# Altium schematic sheet High Speed User IO.SchDoc
size A2; SheetNumber: 12; SheetTotal: 13
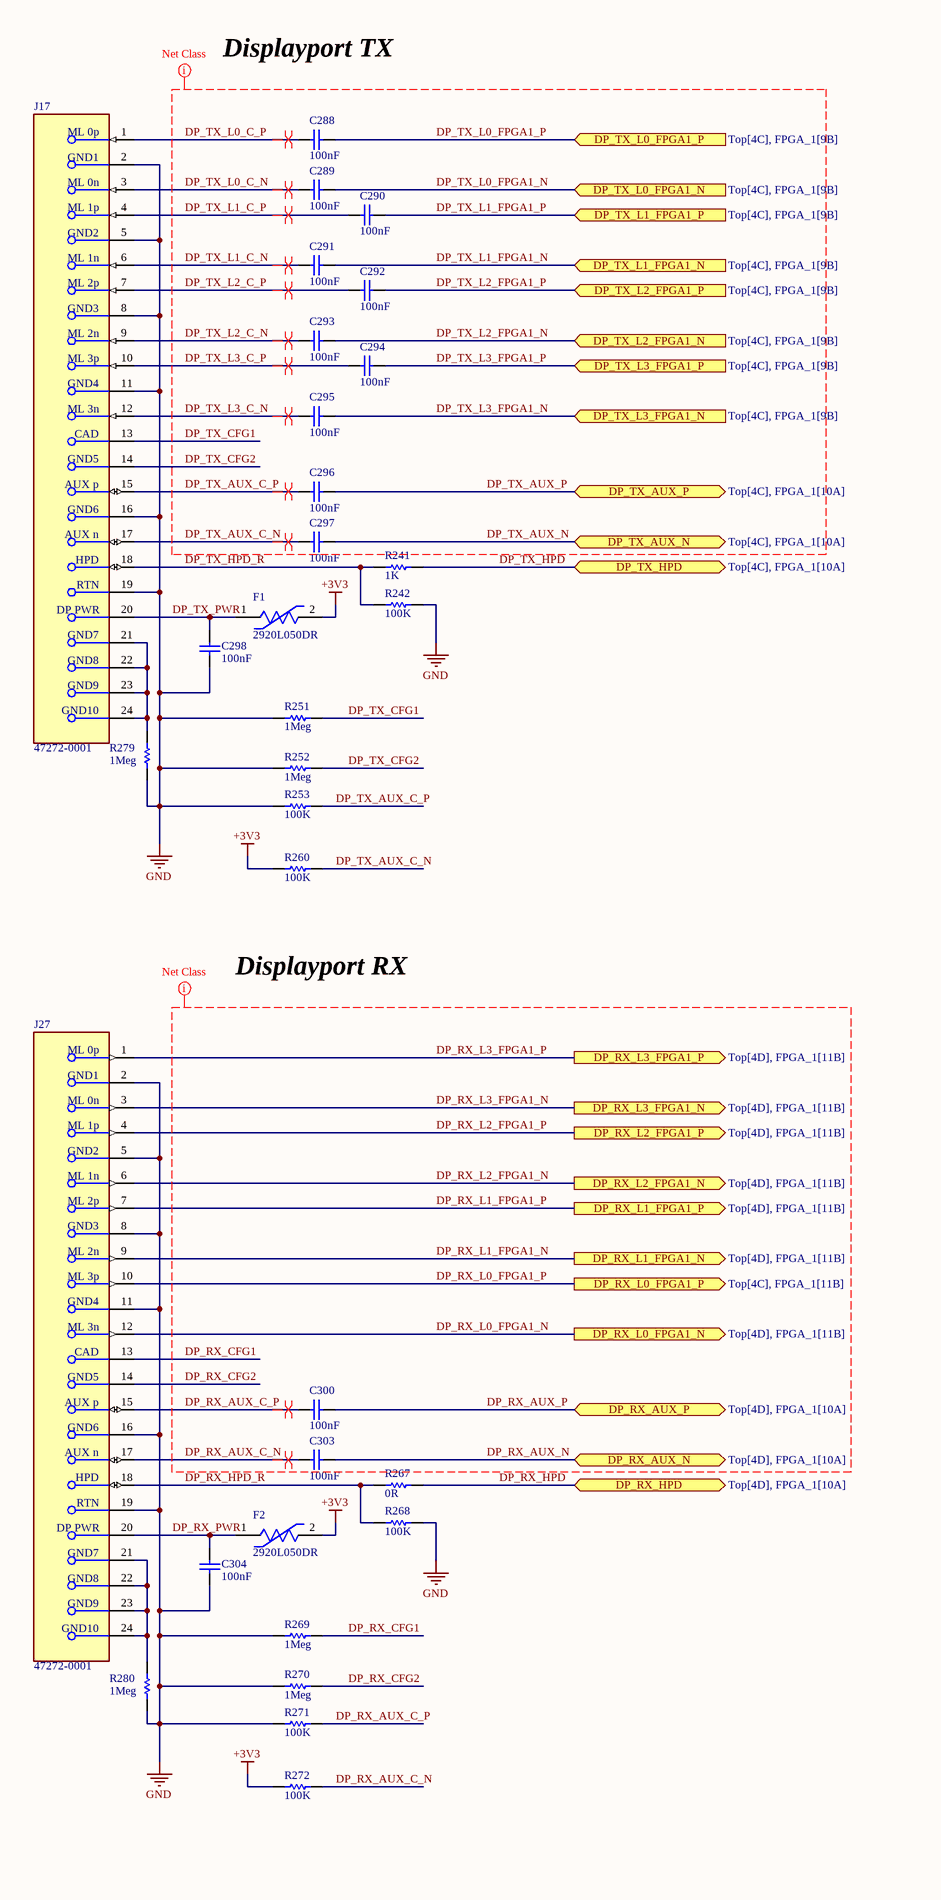
[diagram p0: High Speed User IO.SchDoc, left]
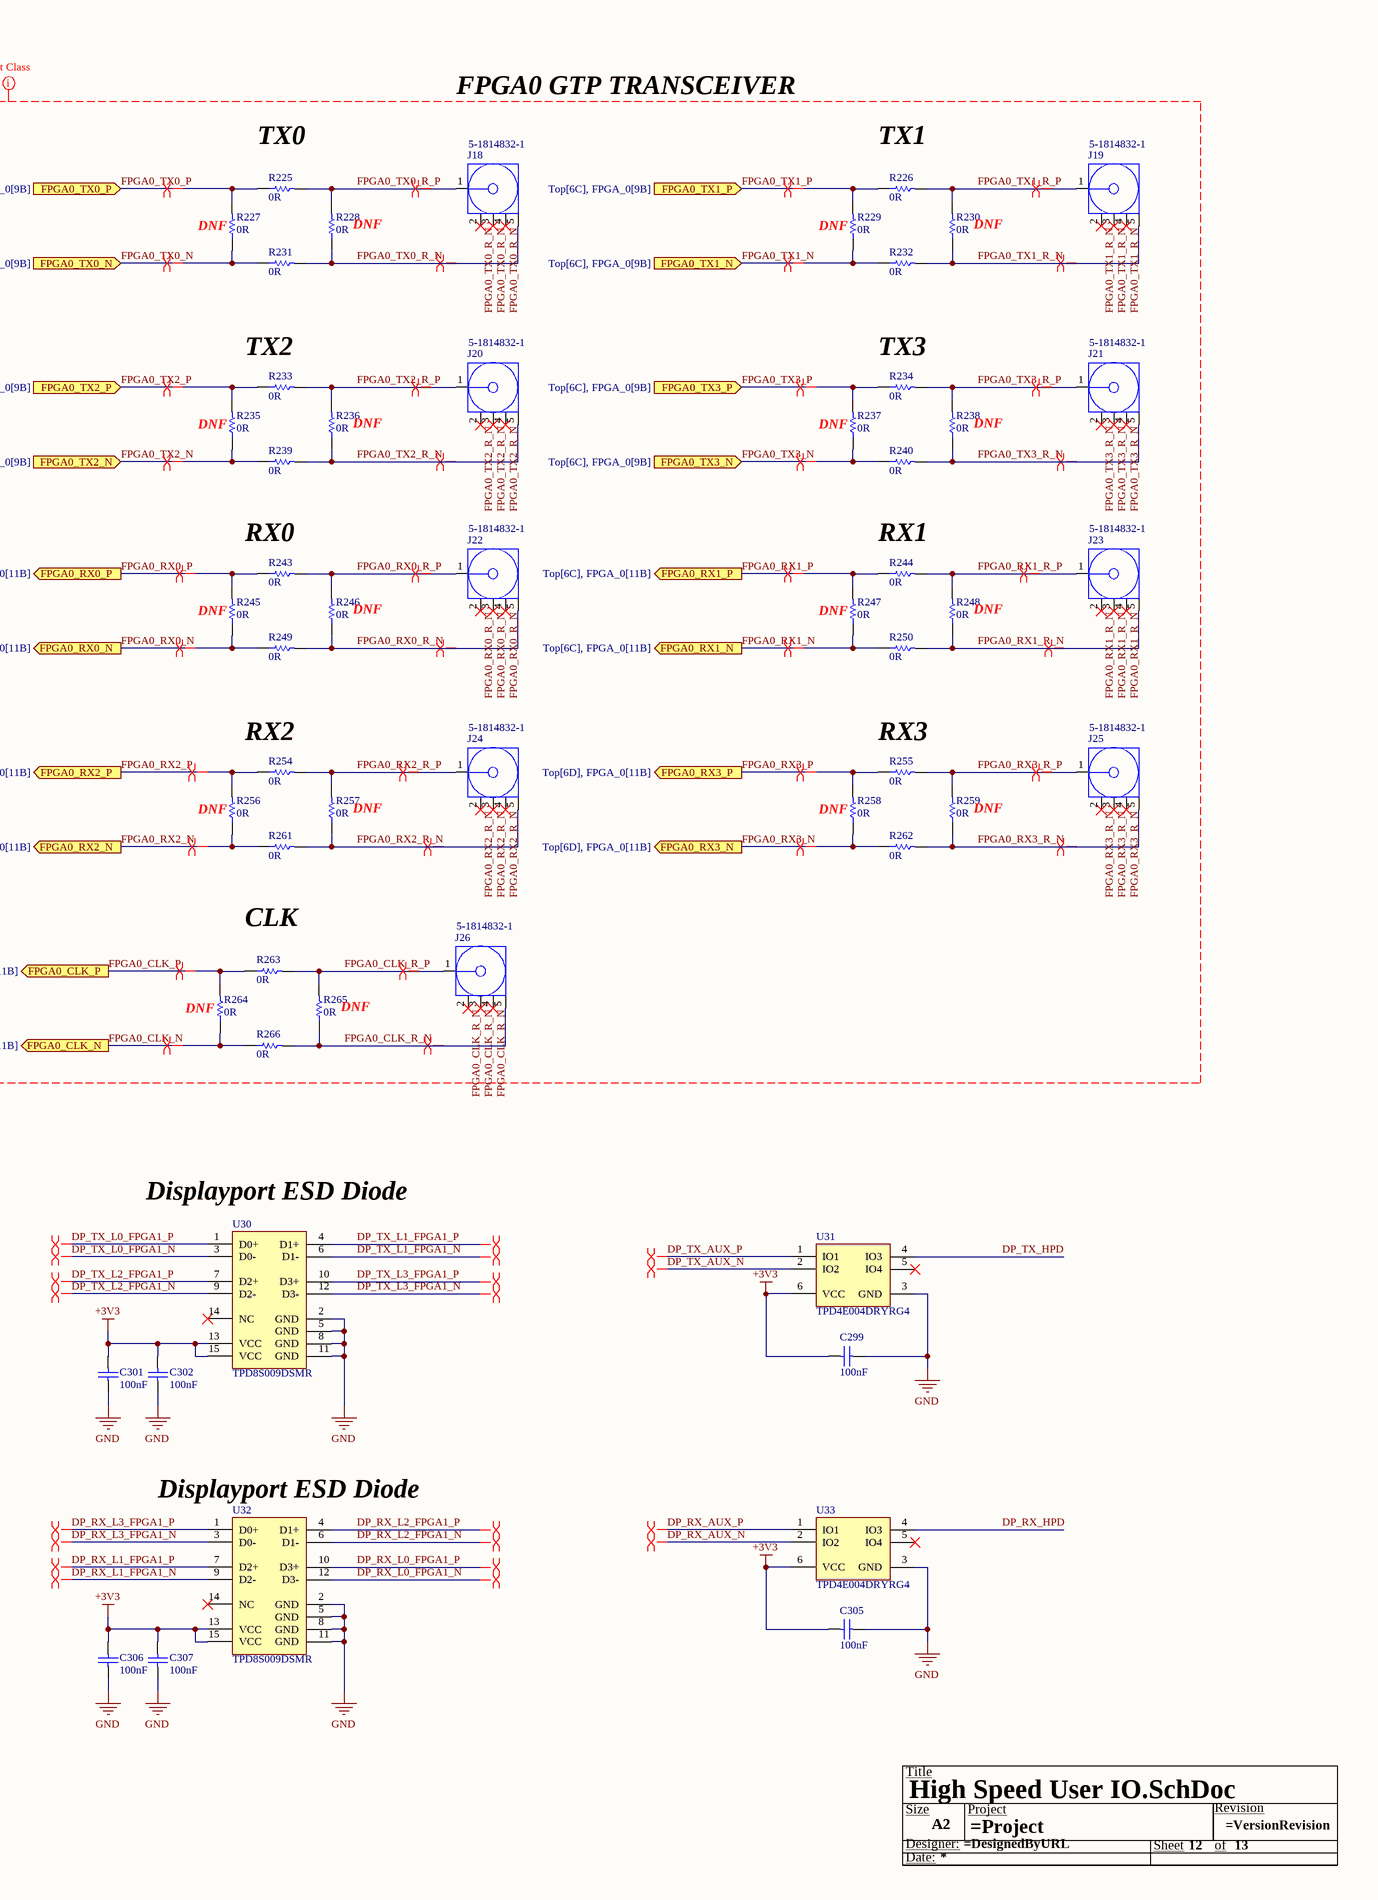
[diagram p1: High Speed User IO.SchDoc, right]

## Parts
*  Size: A2  (hidden comment: Title Block)  (graphical)
C288  100nF  [CAPC1005X05N]
C289  100nF  [CAPC1005X05N]
C290  100nF  [CAPC1005X05N]
C291  100nF  [CAPC1005X05N]
C292  100nF  [CAPC1005X05N]
C293  100nF  [CAPC1005X05N]
C294  100nF  [CAPC1005X05N]
C295  100nF  [CAPC1005X05N]
C296  100nF  [CAPC1005X05N]
C297  100nF  [CAPC1005X05N]
C298  100nF  [CAPC1005X05N]
C299  100nF  [CAPC1005X05N]
C300  100nF  [CAPC1005X05N]
C301  100nF  [CAPC1005X05N]
C302  100nF  [CAPC1005X05N]
C303  100nF  [CAPC1005X05N]
C304  100nF  [CAPC1005X05N]
C305  100nF  [CAPC1005X05N]
C306  100nF  [CAPC1005X05N]
C307  100nF  [CAPC1005X05N]
F1  2920L050DR  [FP-2920L050DR-MFG]
F2  2920L050DR  [FP-2920L050DR-MFG]
J17  47272-0001  [FP-47272-0001-MFG]
J18  5-1814832-1  [TECO-5-1814832-1_V]
J19  5-1814832-1  [TECO-5-1814832-1_V]
J20  5-1814832-1  [TECO-5-1814832-1_V]
J21  5-1814832-1  [TECO-5-1814832-1_V]
J22  5-1814832-1  [TECO-5-1814832-1_V]
J23  5-1814832-1  [TECO-5-1814832-1_V]
J24  5-1814832-1  [TECO-5-1814832-1_V]
J25  5-1814832-1  [TECO-5-1814832-1_V]
J26  5-1814832-1  [TECO-5-1814832-1_V]
J27  47272-0001  [FP-47272-0001-MFG]
R225  0R  [RESC1005X40X25NL05T10]
R226  0R  [RESC1005X40X25NL05T10]
R227  0R  [RESC1005X40X25NL05T10]
R228  0R  [RESC1005X40X25NL05T10]
R229  0R  [RESC1005X40X25NL05T10]
R230  0R  [RESC1005X40X25NL05T10]
R231  0R  [RESC1005X40X25NL05T10]
R232  0R  [RESC1005X40X25NL05T10]
R233  0R  [RESC1005X40X25NL05T10]
R234  0R  [RESC1005X40X25NL05T10]
R235  0R  [RESC1005X40X25NL05T10]
R236  0R  [RESC1005X40X25NL05T10]
R237  0R  [RESC1005X40X25NL05T10]
R238  0R  [RESC1005X40X25NL05T10]
R239  0R  [RESC1005X40X25NL05T10]
R240  0R  [RESC1005X40X25NL05T10]
R241  1K  [RESC1005X40X25NL05T10]
R242  100K  [RESC1005X40X25NL05T05]
R243  0R  [RESC1005X40X25NL05T10]
R244  0R  [RESC1005X40X25NL05T10]
R245  0R  [RESC1005X40X25NL05T10]
R246  0R  [RESC1005X40X25NL05T10]
R247  0R  [RESC1005X40X25NL05T10]
R248  0R  [RESC1005X40X25NL05T10]
R249  0R  [RESC1005X40X25NL05T10]
R250  0R  [RESC1005X40X25NL05T10]
R251  1Meg  [RESC1005X40X25NL05T05]
R252  1Meg  [RESC1005X40X25NL05T05]
R253  100K  [RESC1005X40X25NL05T05]
R254  0R  [RESC1005X40X25NL05T10]
R255  0R  [RESC1005X40X25NL05T10]
R256  0R  [RESC1005X40X25NL05T10]
R257  0R  [RESC1005X40X25NL05T10]
R258  0R  [RESC1005X40X25NL05T10]
R259  0R  [RESC1005X40X25NL05T10]
R260  100K  [RESC1005X40X25NL05T05]
R261  0R  [RESC1005X40X25NL05T10]
R262  0R  [RESC1005X40X25NL05T10]
R263  0R  [RESC1005X40X25NL05T10]
R264  0R  [RESC1005X40X25NL05T10]
R265  0R  [RESC1005X40X25NL05T10]
R266  0R  [RESC1005X40X25NL05T10]
R267  0R  [RESC1005X40X25NL05T10]
R268  100K  [RESC1005X40X25NL05T05]
R269  1Meg  [RESC1005X40X25NL05T05]
R270  1Meg  [RESC1005X40X25NL05T05]
R271  100K  [RESC1005X40X25NL05T05]
R272  100K  [RESC1005X40X25NL05T05]
R279  1Meg  [RESC1005X40X25NL05T05]
R280  1Meg  [RESC1005X40X25NL05T05]
U30  TPD8S009DSMR  [DSM0015A_V]
U31  TPD4E004DRYRG4  [DRY0006A]
U32  TPD8S009DSMR  [DSM0015A_V]
U33  TPD4E004DRYRG4  [DRY0006A]

## Ports
DP_RX_AUX_N (bidir, see Top[4D], FPGA_1[10A]), DP_RX_AUX_P (bidir, see Top[4D], FPGA_1[10A]), DP_RX_HPD (bidir, see Top[4D], FPGA_1[10A]), DP_RX_L0_FPGA1_N (out, see Top[4D], FPGA_1[11B]), DP_RX_L0_FPGA1_P (out, see Top[4C], FPGA_1[11B]), DP_RX_L1_FPGA1_N (out, see Top[4D], FPGA_1[11B]), DP_RX_L1_FPGA1_P (out, see Top[4D], FPGA_1[11B]), DP_RX_L2_FPGA1_N (out, see Top[4D], FPGA_1[11B]), DP_RX_L2_FPGA1_P (out, see Top[4D], FPGA_1[11B]), DP_RX_L3_FPGA1_N (out, see Top[4D], FPGA_1[11B]), DP_RX_L3_FPGA1_P (out, see Top[4D], FPGA_1[11B]), DP_TX_AUX_N (bidir, see Top[4C], FPGA_1[10A]), DP_TX_AUX_P (bidir, see Top[4C], FPGA_1[10A]), DP_TX_HPD (bidir, see Top[4C], FPGA_1[10A]), DP_TX_L0_FPGA1_N (in, see Top[4C], FPGA_1[9B]), DP_TX_L0_FPGA1_P (in, see Top[4C], FPGA_1[9B]), DP_TX_L1_FPGA1_N (in, see Top[4C], FPGA_1[9B]), DP_TX_L1_FPGA1_P (in, see Top[4C], FPGA_1[9B]), DP_TX_L2_FPGA1_N (in, see Top[4C], FPGA_1[9B]), DP_TX_L2_FPGA1_P (in, see Top[4C], FPGA_1[9B]), DP_TX_L3_FPGA1_N (in, see Top[4C], FPGA_1[9B]), DP_TX_L3_FPGA1_P (in, see Top[4C], FPGA_1[9B]), FPGA0_CLK_N (out, see Top[6D], FPGA_0[11B]), FPGA0_CLK_P (out, see Top[6D], FPGA_0[11B]), FPGA0_RX0_N (out, see Top[6C], FPGA_0[11B]), FPGA0_RX0_P (out, see Top[6C], FPGA_0[11B]), FPGA0_RX1_N (out, see Top[6C], FPGA_0[11B]), FPGA0_RX1_P (out, see Top[6C], FPGA_0[11B]), FPGA0_RX2_N (out, see Top[6D], FPGA_0[11B]), FPGA0_RX2_P (out, see Top[6C], FPGA_0[11B]), FPGA0_RX3_N (out, see Top[6D], FPGA_0[11B]), FPGA0_RX3_P (out, see Top[6D], FPGA_0[11B]), FPGA0_TX0_N (in, see Top[6C], FPGA_0[9B]), FPGA0_TX0_P (in, see Top[6C], FPGA_0[9B]), FPGA0_TX1_N (in, see Top[6C], FPGA_0[9B]), FPGA0_TX1_P (in, see Top[6C], FPGA_0[9B]), FPGA0_TX2_N (in, see Top[6C], FPGA_0[9B]), FPGA0_TX2_P (in, see Top[6C], FPGA_0[9B]), FPGA0_TX3_N (in, see Top[6C], FPGA_0[9B]), FPGA0_TX3_P (in, see Top[6C], FPGA_0[9B])

## Nets
+3V3: C299.1 C301.1 C302.1 C305.1 C306.1 C307.1 F1.2 F2.2 R260.1 R272.1 U30.13(VCC) U30.15(VCC) U31.6(VCC) U32.13(VCC) U32.15(VCC) U33.6(VCC)
GND: C298.2 C299.2 C301.2 C302.2 C304.2 C305.2 C306.2 C307.2 J17.2(GND1) J17.5(GND2) J17.8(GND3) J17.11(GND4) J17.16(GND6) J17.19(RTN) J27.2(GND1) J27.5(GND2) J27.8(GND3) J27.11(GND4) J27.16(GND6) J27.19(RTN) R242.2 R251.1 R252.1 R253.1 R268.2 R269.1 R270.1 R271.1 R279.2 R280.1 U30.2(GND) U30.5(GND) U30.8(GND) U30.11(GND) U31.3(GND) U32.2(GND) U32.5(GND) U32.8(GND) U32.11(GND) U33.3(GND)
DP_RX_AUX_C_N: C303.2 J27.17(AUX_n) R272.2
DP_RX_AUX_C_P: C300.2 J27.15(AUX_p) R271.2
DP_RX_AUX_N: C303.1 U33.2(IO2) ; port DP_RX_AUX_N
DP_RX_AUX_P: C300.1 U33.1(IO1) ; port DP_RX_AUX_P
DP_RX_CFG1: J27.13(CAD) R269.2
DP_RX_CFG2: J27.14(GND5) R270.2
DP_RX_HPD: R267.2 U33.4(IO3) ; port DP_RX_HPD
DP_RX_HPD_R: J27.18(HPD) R267.1 R268.1
DP_RX_L0_FPGA1_N: J27.12(ML_3n) U32.12(D3-) ; port DP_RX_L0_FPGA1_N
DP_RX_L0_FPGA1_P: J27.10(ML_3p) U32.10(D3+) ; port DP_RX_L0_FPGA1_P
DP_RX_L1_FPGA1_N: J27.9(ML_2n) U32.9(D2-) ; port DP_RX_L1_FPGA1_N
DP_RX_L1_FPGA1_P: J27.7(ML_2p) U32.7(D2+) ; port DP_RX_L1_FPGA1_P
DP_RX_L2_FPGA1_N: J27.6(ML_1n) U32.6(D1-) ; port DP_RX_L2_FPGA1_N
DP_RX_L2_FPGA1_P: J27.4(ML_1p) U32.4(D1+) ; port DP_RX_L2_FPGA1_P
DP_RX_L3_FPGA1_N: J27.3(ML_0n) U32.3(D0-) ; port DP_RX_L3_FPGA1_N
DP_RX_L3_FPGA1_P: J27.1(ML_0p) U32.1(D0+) ; port DP_RX_L3_FPGA1_P
DP_RX_PWR: C304.1 F2.1 J27.20(DP_PWR)
DP_TX_AUX_C_N: C297.2 J17.17(AUX_n) R260.2
DP_TX_AUX_C_P: C296.2 J17.15(AUX_p) R253.2
DP_TX_AUX_N: C297.1 U31.2(IO2) ; port DP_TX_AUX_N
DP_TX_AUX_P: C296.1 U31.1(IO1) ; port DP_TX_AUX_P
DP_TX_CFG1: J17.13(CAD) R251.2
DP_TX_CFG2: J17.14(GND5) R252.2
DP_TX_HPD: R241.2 U31.4(IO3) ; port DP_TX_HPD
DP_TX_HPD_R: J17.18(HPD) R241.1 R242.1
DP_TX_L0_C_N: C289.2 J17.3(ML_0n)
DP_TX_L0_C_P: C288.2 J17.1(ML_0p)
DP_TX_L0_FPGA1_N: C289.1 U30.3(D0-) ; port DP_TX_L0_FPGA1_N
DP_TX_L0_FPGA1_P: C288.1 U30.1(D0+) ; port DP_TX_L0_FPGA1_P
DP_TX_L1_C_N: C291.2 J17.6(ML_1n)
DP_TX_L1_C_P: C290.2 J17.4(ML_1p)
DP_TX_L1_FPGA1_N: C291.1 U30.6(D1-) ; port DP_TX_L1_FPGA1_N
DP_TX_L1_FPGA1_P: C290.1 U30.4(D1+) ; port DP_TX_L1_FPGA1_P
DP_TX_L2_C_N: C293.2 J17.9(ML_2n)
DP_TX_L2_C_P: C292.2 J17.7(ML_2p)
DP_TX_L2_FPGA1_N: C293.1 U30.9(D2-) ; port DP_TX_L2_FPGA1_N
DP_TX_L2_FPGA1_P: C292.1 U30.7(D2+) ; port DP_TX_L2_FPGA1_P
DP_TX_L3_C_N: C295.2 J17.12(ML_3n)
DP_TX_L3_C_P: C294.2 J17.10(ML_3p)
DP_TX_L3_FPGA1_N: C295.1 U30.12(D3-) ; port DP_TX_L3_FPGA1_N
DP_TX_L3_FPGA1_P: C294.1 U30.10(D3+) ; port DP_TX_L3_FPGA1_P
DP_TX_PWR: C298.1 F1.1 J17.20(DP_PWR)
FPGA0_CLK_N: R264.1 R266.1 ; port FPGA0_CLK_N
FPGA0_CLK_P: R263.1 R264.2 ; port FPGA0_CLK_P
FPGA0_CLK_R_N: J26.2 J26.3 J26.4 J26.5 R265.1 R266.2
FPGA0_CLK_R_P: J26.1 R263.2 R265.2
FPGA0_RX0_N: R245.1 R249.1 ; port FPGA0_RX0_N
FPGA0_RX0_P: R243.1 R245.2 ; port FPGA0_RX0_P
FPGA0_RX0_R_N: J22.2 J22.3 J22.4 J22.5 R246.1 R249.2
FPGA0_RX0_R_P: J22.1 R243.2 R246.2
FPGA0_RX1_N: R247.1 R250.1 ; port FPGA0_RX1_N
FPGA0_RX1_P: R244.1 R247.2 ; port FPGA0_RX1_P
FPGA0_RX1_R_N: J23.2 J23.3 J23.4 J23.5 R248.1 R250.2
FPGA0_RX1_R_P: J23.1 R244.2 R248.2
FPGA0_RX2_N: R256.1 R261.1 ; port FPGA0_RX2_N
FPGA0_RX2_P: R254.1 R256.2 ; port FPGA0_RX2_P
FPGA0_RX2_R_N: J24.2 J24.3 J24.4 J24.5 R257.1 R261.2
FPGA0_RX2_R_P: J24.1 R254.2 R257.2
FPGA0_RX3_N: R258.1 R262.1 ; port FPGA0_RX3_N
FPGA0_RX3_P: R255.1 R258.2 ; port FPGA0_RX3_P
FPGA0_RX3_R_N: J25.2 J25.3 J25.4 J25.5 R259.1 R262.2
FPGA0_RX3_R_P: J25.1 R255.2 R259.2
FPGA0_TX0_N: R227.1 R231.1 ; port FPGA0_TX0_N
FPGA0_TX0_P: R225.1 R227.2 ; port FPGA0_TX0_P
FPGA0_TX0_R_N: J18.2 J18.3 J18.4 J18.5 R228.1 R231.2
FPGA0_TX0_R_P: J18.1 R225.2 R228.2
FPGA0_TX1_N: R229.1 R232.1 ; port FPGA0_TX1_N
FPGA0_TX1_P: R226.1 R229.2 ; port FPGA0_TX1_P
FPGA0_TX1_R_N: J19.2 J19.3 J19.4 J19.5 R230.1 R232.2
FPGA0_TX1_R_P: J19.1 R226.2 R230.2
FPGA0_TX2_N: R235.1 R239.1 ; port FPGA0_TX2_N
FPGA0_TX2_P: R233.1 R235.2 ; port FPGA0_TX2_P
FPGA0_TX2_R_N: J20.2 J20.3 J20.4 J20.5 R236.1 R239.2
FPGA0_TX2_R_P: J20.1 R233.2 R236.2
FPGA0_TX3_N: R237.1 R240.1 ; port FPGA0_TX3_N
FPGA0_TX3_P: R234.1 R237.2 ; port FPGA0_TX3_P
FPGA0_TX3_R_N: J21.2 J21.3 J21.4 J21.5 R238.1 R240.2
FPGA0_TX3_R_P: J21.1 R234.2 R238.2
NetJ17_21: J17.21(GND7) J17.22(GND8) J17.23(GND9) J17.24(GND10) R279.1
NetJ27_21: J27.21(GND7) J27.22(GND8) J27.23(GND9) J27.24(GND10) R280.2

Not connected (* = marked no-connect by the designer): U30 14(NC)*; U31 5(IO4)*; U32 14(NC)*; U33 5(IO4)*

## Layout directives
net class FPGA1 DP RX: DP_RX_AUX_C_N, DP_RX_AUX_C_P, DP_RX_AUX_N, DP_RX_AUX_P, DP_RX_CFG1, DP_RX_CFG2, DP_RX_L0_FPGA1_N, DP_RX_L0_FPGA1_P, DP_RX_L1_FPGA1_N, DP_RX_L1_FPGA1_P, DP_RX_L2_FPGA1_N, DP_RX_L2_FPGA1_P, DP_RX_L3_FPGA1_N, DP_RX_L3_FPGA1_P
net class FPGA1 DP TX: DP_TX_AUX_C_N, DP_TX_AUX_C_P, DP_TX_AUX_N, DP_TX_AUX_P, DP_TX_CFG1, DP_TX_CFG2, DP_TX_L0_C_N, DP_TX_L0_C_P, DP_TX_L0_FPGA1_N, DP_TX_L0_FPGA1_P, DP_TX_L1_C_N, DP_TX_L1_C_P, DP_TX_L1_FPGA1_N, DP_TX_L1_FPGA1_P, DP_TX_L2_C_N, DP_TX_L2_C_P, DP_TX_L2_FPGA1_N, DP_TX_L2_FPGA1_P, DP_TX_L3_C_N, DP_TX_L3_C_P, DP_TX_L3_FPGA1_N, DP_TX_L3_FPGA1_P
net class FPGA1 GPT TRANSCEIVERS: FPGA0_CLK_N, FPGA0_CLK_P, FPGA0_CLK_R_N, FPGA0_CLK_R_P, FPGA0_RX0_N, FPGA0_RX0_P, FPGA0_RX0_R_N, FPGA0_RX0_R_P, FPGA0_RX1_N, FPGA0_RX1_P, FPGA0_RX1_R_N, FPGA0_RX1_R_P, FPGA0_RX2_N, FPGA0_RX2_P, FPGA0_RX2_R_N, FPGA0_RX2_R_P, FPGA0_RX3_N, FPGA0_RX3_P, FPGA0_RX3_R_N, FPGA0_RX3_R_P, FPGA0_TX0_N, FPGA0_TX0_P, FPGA0_TX0_R_N, FPGA0_TX0_R_P, FPGA0_TX1_N, FPGA0_TX1_P, FPGA0_TX1_R_N, FPGA0_TX1_R_P, FPGA0_TX2_N, FPGA0_TX2_P, FPGA0_TX2_R_N, FPGA0_TX2_R_P, FPGA0_TX3_N, FPGA0_TX3_P, FPGA0_TX3_R_N, FPGA0_TX3_R_P
differential pair: DP_RX_AUX_C_N, DP_RX_AUX_C_P, DP_RX_AUX_N, DP_RX_AUX_P, DP_RX_L0_FPGA1_N, DP_RX_L0_FPGA1_P, DP_RX_L1_FPGA1_N, DP_RX_L1_FPGA1_P, DP_RX_L2_FPGA1_N, DP_RX_L2_FPGA1_P, DP_RX_L3_FPGA1_N, DP_RX_L3_FPGA1_P, DP_TX_AUX_C_N, DP_TX_AUX_C_P, DP_TX_AUX_N, DP_TX_AUX_P, DP_TX_L0_C_N, DP_TX_L0_C_P, DP_TX_L0_FPGA1_N, DP_TX_L0_FPGA1_P, DP_TX_L1_C_N, DP_TX_L1_C_P, DP_TX_L1_FPGA1_N, DP_TX_L1_FPGA1_P, DP_TX_L2_C_N, DP_TX_L2_C_P, DP_TX_L2_FPGA1_N, DP_TX_L2_FPGA1_P, DP_TX_L3_C_N, DP_TX_L3_C_P, DP_TX_L3_FPGA1_N, DP_TX_L3_FPGA1_P, FPGA0_CLK_N, FPGA0_CLK_P, FPGA0_CLK_R_N, FPGA0_CLK_R_P, FPGA0_RX0_N, FPGA0_RX0_P, FPGA0_RX0_R_N, FPGA0_RX0_R_P, FPGA0_RX1_N, FPGA0_RX1_P, FPGA0_RX1_R_N, FPGA0_RX1_R_P, FPGA0_RX2_N, FPGA0_RX2_P, FPGA0_RX2_R_N, FPGA0_RX2_R_P, FPGA0_RX3_N, FPGA0_RX3_P, FPGA0_RX3_R_N, FPGA0_RX3_R_P, FPGA0_TX0_N, FPGA0_TX0_P, FPGA0_TX0_R_N, FPGA0_TX0_R_P, FPGA0_TX1_N, FPGA0_TX1_P, FPGA0_TX1_R_N, FPGA0_TX1_R_P, FPGA0_TX2_N, FPGA0_TX2_P, FPGA0_TX2_R_N, FPGA0_TX2_R_P, FPGA0_TX3_N, FPGA0_TX3_P, FPGA0_TX3_R_N, FPGA0_TX3_R_P

## Notes on the sheet
- Displayport TX
- FPGA0 GTP TRANSCEIVER
- (near R225) TX0
- (near R226) TX1
- (near R227) DNF
- (near R228) DNF
- (near R229) DNF
- (near R230) DNF
- (near R233) TX2
- (near R234) TX3
- (near R235) DNF
- (near R236) DNF
- (near R237) DNF
- (near R238) DNF
- (near R243) RX0
- (near R244) RX1
- (near R245) DNF
- (near R246) DNF
- (near R247) DNF
- (near R248) DNF
- (near R254) RX2
- (near R255) RX3
- (near R256) DNF
- (near R257) DNF
- (near R258) DNF
- (near R259) DNF
- CLK
- Displayport RX
- (near R264) DNF
- (near R265) DNF
- (near U30) Displayport ESD Diode
- (near U32) Displayport ESD Diode
- (in symbol CMP-007-000006-8) Title; Size; Project; Revision; Designer:; Sheet; of; Date:

## Library data of the parts
* = CMP-007-000006-8: Generic Title Block
C288-C307 = CMP-001-00095-1: Cap Ceramic 0.1uF 50V X7R 20% SMD 0402 125°C Paper T/R GRM155R71H104ME14J; Voltage: 50V; Capacitance: 100nF; Case: 0402
F1 F2 = CMP-08606-000071-1: PTC RESET FUSE 60V 500MA 2920; Resistance: 1.4R; Trip Current: 1A; Power Dissipation: 1.5W; Time to Trip: 4s; Approvals: cULus; Current Rating: 10A; Operating Supply Voltage: 60V; Termination: SMD/SMT; Width: 5.44mm; Case/Package: 2920; Series: 2920L; Case Code (Imperial): 2920; Height: 1.25mm; Hold Current: 500mA; Terminal Material: Copper; Min Operating Temperature: -40°C; Package Quantity: 1500; Max Voltage Rating (DC): 60V; RoHS Compliant: Yes; Case Code (Metric): 7351; Lead Free: Lead Free; Max Operating Temperature: 85°C; Voltage Rating (DC): 60V; Working Voltage: 60V; Length: 7.98mm; REACH SVHC: No SVHC; Max Current Rating: 10A; Voltage Rating: 60V; Packaging: Tape and Reel
J17 J27 = CMP-2000-05608-2: CONN RCPT DISPLAYPORT 20P SMD RA; Manufacturer: Molex; Voltage Rating: 40V; Is Female: yes; Shielding: true; Number Of Contacts: 20; Conn Orientation: Right Angle; Current Rating: 0.5A; Pitch: 0.5mm; Device Class L2: Audio / Video Connectors; Temperature: -20°C to +85°C; Contact Material: Gold,Nickel; Footprint Url: https://www.molex.com/pdm_docs/sd/472720001_sd.pdf; Device Class L1: Connectors; ComponentLink2Description: Datasheet; Temperature Range Low: -20°C; Automotive: No; Package: 0; Height: 6.9mm; RoHS: TRUE; Octopart: https://octopart.com/47272-0001-molex-5441289; Lead Free: Yes; ComponentLink2URL: https://www.molex.com/webdocs/datasheets/pdf/en-us/0472720001_IO_CONNECTORS.pdf; Device Class L3: unset; Mouser Description: HDMI, Displayport & DVI Connectors .5MM RA SMT RCPT; Category: Conn; Manufacturer Part Number: 47272-0001; Digikey Description: CONN RCPT DISPLAYPORT 20P SMD RA; Temperature Range High: +85°C
J18-J26 = CMP-2000-05415-1: SMA Connector, Pitch 5.08 mm, 1 Position, Height 9.5 mm, Tail Length 4 mm, -65 to 165 degC, RoHS, Bulk; Manufacturer: TE Connectivity; Connector Mounting: PCBMount; Connector Body Style: StraightJack; Impedance: 50ohm; Coaxial Termination: Solder; SVHC: NoSVHC(15-Jun-2015); Frequency Max: 3GHz; Product Range: ZDCSeries; Connector Type: SMACoaxial; Datasheet Version: Rev. B1, 03/2011; Package Reference: 5-1814832-1; Package Description: SMA Connector, Pitch 5.08 mm, 1 Position, Height 9.5 mm, Tail Length 4 mm; Contact Plating: GoldPlatedContacts; Coaxial Cable Types: -; Contact Material: BerylliumCopper; Manufacturer URL: http://www.te.com/; Datasheet URL: http://www.onlinecomponents.com/productFiles/mf-AMP/eng_cd_1814832_a.pdf
R225-R240 R243-R250 R254-R259 R261-R267 = CMP-2002-03041-1: CRCW04020000Z0EDHP; Manufacturer: Vishay Dale; Part Number: CRCW04020000Z0EDHP
R241 = CMP-2002-03045-1: CRCW04021K00FKEDHP; Manufacturer: Vishay Dale; Part Number: CRCW04021K00FKEDHP
R242 R253 R260 R268 R271 R272 = CMP-2002-08125-1: CRCW0402100KJNED; Manufacturer: Vishay Dale; Part Number: CRCW0402100KJNED
R251 R252 R269 R270 R279 R280 = CMP-1011-00146-2: ERJ-2GEJ105X; Manufacturer: Panasonic; Part Number: ERJ-2GEJ105X
U30 U32 = CMP-0326-00039-2: ESD Solution for HDMI / DisplayPort, 8 Channels, -40 to +85 degC, 15-pin SON (DSM); Manufacturer: Texas Instruments; IEC 61000-4-2 Contact(+/- kV): 8; IO Leakage Current(nA): 10; Breakdown Voltage(Min)(V): 9; Differential Capacitance(pF): 0.05; IO Capacitance(Typ)(pF): 0.8; Eco-Plan: TBD; PartNumber: TPD8S009DSMR; ComponentLink3URL: SamplesURL:http://www.ti.com/product/tpd8s009#samples; ComponentLink2URL: http://www.ti.com/general/docs/lit/getliterature.tsp?genericPartNumber=TPD8S009&fileType=pdf; PackageDescription: 15-Pin Plastic Small Outline Flat No-Lead, 2.5 x 6.5 x 0.8 mm Body, 0.5/1.5 mm Pitch; ComponentLink3Description: URL Link1; ComponentLink1Description: Manufacturer URL; DatasheetVersion: SLVS816; ComponentLink1URL: http://www.ti.com/; PackageReference: DSM0015A; IEC 61000-4-2 Air-Gap(+/- kV): 9; Mounting Technology: Surface Mount; ComponentLink2Description: Datasheet; PackageVersion: revA, Aug-2007; SubFamily: ESD Solution
U31 U33 = CMP-0326-00023-2: ESD-Protection Array for High-Speed Data Interfaces, 4 Channels, -40 to +85 degC, 6-pin SON (DRY), Green (RoHS & no Sb/Br); Manufacturer: Texas Instruments; Serial ATA / eSATA: TRUE; IO Leakage Current(nA): 1; IEC 61000-4-2 Air-Gap(+/- kV): 12; Breakdown Voltage(Min)(V): 6; IEC 61000-4-2 Contact(+/- kV): 8; IO Capacitance(Typ)(pF): 1.6; SubFamily: ESD Solution; ComponentLink1Description: Manufacturer URL; ComponentLink2URL: http://www.ti.com/general/docs/lit/getliterature.tsp?genericPartNumber=TPD4E004&fileType=pdf; PartNumber: TPD4E004DRYRG4; 1394 / Firewire: TRUE; DatasheetVersion: SLVS729A; PackageReference: DRY0006A; ComponentLink1URL: http://www.ti.com/; Eco-Plan: Green (RoHS & no Sb/Br); ComponentLink3Description: URL Link1; ComponentLink2Description: Datasheet; USB High Speed: TRUE; Mounting Technology: Surface Mount; PackageDescription: 6-Pin Plastic Small Outline No-Lead, 1 x 1.45 x 0.6 mm Body, 0.5 mm Pitch; PackageVersion: revF, Dec-2011; ComponentLink3URL: SamplesURL:http://www.ti.com/product/tpd4e004#samples